# EAGLE schematic RGBDisplayDriver (EAGLE 7.3.0)
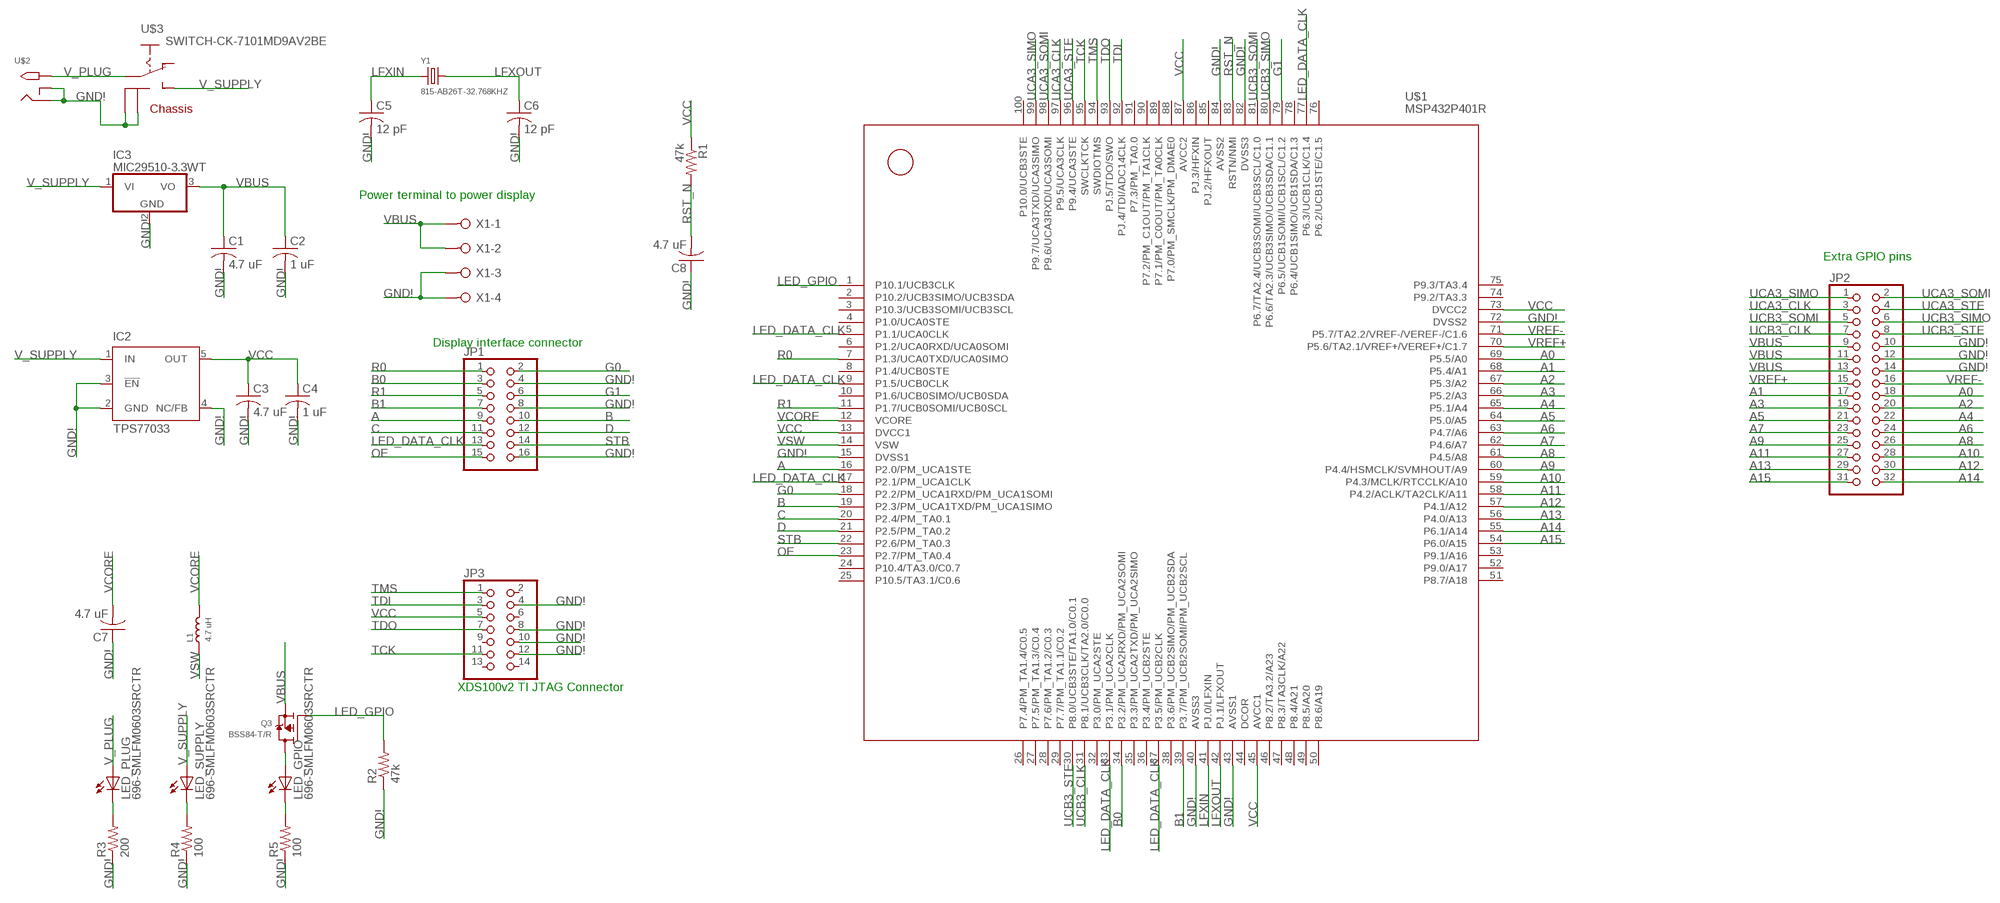
[diagram p0: schematic, sheet 1]

## Parts
C1  4.7 uF  C-USC0603  [C0603]
C2  1 uF  C-USC0603  [C0603]
C3  4.7 uF  C-USC0603  [C0603]
C4  1 uF  C-USC0603  [C0603]
C5  12 pF  C-USC0603  [C0603]
C6  12 pF  C-USC0603  [C0603]
C7  4.7 uF  C-USC0603  [C0603]
C8  4.7 uF  C-USC0603  [C0603]
IC2  TPS77033  [SOT23-DBV]
IC3  MIC29510-3.3WT  7805TV  [TO220V]
JP1  PINHD-2X8  [2X08]
JP2  PINHD-2X16  [2X16]
JP3  PINHD-2X7  [2X07]
L1  4.7 uH  SMD-FERRITE-CHIP-120-OHM-500MA(0603)  [L0603]
LED_GPIO  696-SMLFM0603SRCTR  LEDCHIPLED_0603  [CHIPLED_0603]
LED_PLUG  696-SMLFM0603SRCTR  LEDCHIPLED_0603  [CHIPLED_0603]
LED_SUPPLY  696-SMLFM0603SRCTR  LEDCHIPLED_0603  [CHIPLED_0603]
Q3  BSS84-T/R  MOSFET-PWIDE  [SOT23-WIDE]
R1  47k  R-US_R0603  [R0603]
R2  47k  R-US_R0603  [R0603]
R3  200  R-US_R0603  [R0603]
R4  100  R-US_R0603  [R0603]
R5  100  R-US_R0603  [R0603]
U$1  MSP432P401R  MSP432P401XPZ  [LQFP100]
U$2  2.1MMJACKTHM  [PJ-102A]
U$3  SWITCH-CK-7101MD9AV2BE  [SWITCH-CK-7101MD9AV2BE]
X1  W237-04P  [W237-4P]
Y1  815-AB26T-32.768KHZ  CRYSTAL32.768  [CRYSTAL_CYL_2X6MM_SMT]

## Nets
A: JP1.9 U$1.16(P2.0/PM_UCA1STE)
A0: JP2.18 U$1.69(P5.5/A0)
A1: JP2.17 U$1.68(P5.4/A1)
A2: JP2.20 U$1.67(P5.3/A2)
A3: JP2.19 U$1.66(P5.2/A3)
A4: JP2.22 U$1.65(P5.1/A4)
A5: JP2.21 U$1.64(P5.0/A5)
A6: JP2.24 U$1.63(P4.7/A6)
A7: JP2.23 U$1.62(P4.6/A7)
A8: JP2.26 U$1.61(P4.5/A8)
A9: JP2.25 U$1.60(P4.4/HSMCLK/SVMHOUT/A9)
A10: JP2.28 U$1.59(P4.3/MCLK/RTCCLK/A10)
A11: JP2.27 U$1.58(P4.2/ACLK/TA2CLK/A11)
A12: JP2.30 U$1.57(P4.1/A12)
A13: JP2.29 U$1.56(P4.0/A13)
A14: JP2.32 U$1.55(P6.1/A14)
A15: JP2.31 U$1.54(P6.0/A15)
B: JP1.10 U$1.19(P2.3/PM_UCA1TXD/PM_UCA1SIMO)
B0: JP1.3 U$1.34(P3.2/PM_UCA2RXD/PM_UCA2SOMI)
B1: JP1.7 U$1.39(P3.7/PM_UCB2SOMI/PM_UCB2SCL)
C: JP1.11 U$1.20(P2.4/PM_TA0.1)
D: JP1.12 U$1.21(P2.5/PM_TA0.2)
G0: JP1.2 U$1.18(P2.2/PM_UCA1RXD/PM_UCA1SOMI)
G1: JP1.6 U$1.79(P6.5/UCB1SOMI/UCB1SCL/C1.2)
GND!: C1.2 C2.2 C3.2 C4.2 C5.2 C6.2 C7.1 C8.1 IC2.2(GND) IC2.3(!EN) IC2.4(NC/FB) IC3.2(GND) JP1.4 JP1.8 JP1.16 JP2.10 JP2.12 JP2.14 JP3.4 JP3.8 JP3.10 JP3.12 R2.1 R3.1 R4.1 R5.1 U$1.15(DVSS1) U$1.40(AVSS3) U$1.43(AVSS1) U$1.72(DVSS2) U$1.82(DVSS3) U$1.84(AVSS2) U$2.RING U$2.RING_SW U$3.P$4 U$3.P$5 X1.3 X1.4
LED_DATA_CLK: JP1.13 U$1.5(P1.1/UCA0CLK) U$1.9(P1.5/UCB0CLK) U$1.17(P2.1/PM_UCA1CLK) U$1.33(P3.1/PM_UCA2CLK) U$1.37(P3.5/PM_UCB2CLK) U$1.77(P6.3/UCB1CLK/C1.4)
LED_GPIO: Q3.1(G) R2.2 U$1.1(P10.1/UCB3CLK)
LFXIN: C5.1 U$1.41(PJ.0/LFXIN) Y1.1
LFXOUT: C6.1 U$1.42(PJ.1/LFXOUT) Y1.2
N$1: LED_GPIO.A Q3.3(D)
N$2: LED_PLUG.C R3.2
N$3: LED_SUPPLY.C R4.2
N$4: LED_GPIO.C R5.2
OE: JP1.15 U$1.23(P2.7/PM_TA0.4)
R0: JP1.1 U$1.7(P1.3/UCA0TXD/UCA0SIMO)
R1: JP1.5 U$1.11(P1.7/UCB0SOMI/UCB0SCL)
RST_N: C8.2 R1.2 U$1.83(RSTN/NMI)
STB: JP1.14 U$1.22(P2.6/PM_TA0.3)
TCK: JP3.11 U$1.95(SWCLKTCK)
TDI: JP3.3 U$1.92(PJ.4/TDI/ADC14CLK)
TDO: JP3.7 U$1.93(PJ.5/TDO/SWO)
TMS: JP3.1 U$1.94(SWDIOTMS)
UCA3_CLK: JP2.3 U$1.97(P9.5/UCA3CLK)
UCA3_SIMO: JP2.1 U$1.99(P9.7/UCA3TXD/UCA3SIMO)
UCA3_SOMI: JP2.2 U$1.98(P9.6/UCA3RXD/UCA3SOMI)
UCA3_STE: JP2.4 U$1.96(P9.4/UCA3STE)
UCB3_CLK: JP2.7 U$1.31(P8.1/UCB3CLK/TA2.0/C0.0)
UCB3_SIMO: JP2.6 U$1.80(P6.6/TA2.3/UCB3SIMO/UCB3SDA/C1.1)
UCB3_SOMI: JP2.5 U$1.81(P6.7/TA2.4/UCB3SOMI/UCB3SCL/C1.0)
UCB3_STE: JP2.8 U$1.30(P8.0/UCB3STE/TA1.0/C0.1)
V_PLUG: LED_PLUG.A U$2.TIP U$3.P$2
V_SUPPLY: IC2.1(IN) IC3.1(VI) LED_SUPPLY.A U$3.P$1
VBUS: C1.1 C2.1 IC3.3(VO) JP2.9 JP2.11 JP2.13 Q3.2(S) X1.1 X1.2
VCC: C3.1 C4.1 IC2.5(OUT) JP3.5 R1.1 U$1.13(DVCC1) U$1.45(AVCC1) U$1.73(DVCC2) U$1.87(AVCC2)
VCORE: C7.2 L1.2 U$1.12(VCORE)
VREF+: JP2.15 U$1.70(P5.6/TA2.1/VREF+/VEREF+/C1.7)
VREF-: JP2.16 U$1.71(P5.7/TA2.2/VREF-/VEREF-/C1.6)
VSW: L1.1 U$1.14(VSW)
Unconnected: JP3.2 JP3.6 JP3.9 JP3.13 JP3.14 U$1.2(P10.2/UCB3SIMO/UCB3SDA) U$1.3(P10.3/UCB3SOMI/UCB3SCL) U$1.4(P1.0/UCA0STE) U$1.6(P1.2/UCA0RXD/UCA0SOMI) U$1.8(P1.4/UCB0STE) U$1.10(P1.6/UCB0SIMO/UCB0SDA) U$1.24(P10.4/TA3.0/C0.7) U$1.25(P10.5/TA3.1/C0.6) U$1.26(P7.4/PM_TA1.4/C0.5) U$1.27(P7.5/PM_TA1.3/C0.4) U$1.28(P7.6/PM_TA1.2/C0.3) U$1.29(P7.7/PM_TA1.1/C0.2) U$1.32(P3.0/PM_UCA2STE) U$1.35(P3.3/PM_UCA2TXD/PM_UCA2SIMO) U$1.36(P3.4/PM_UCB2STE) U$1.38(P3.6/PM_UCB2SIMO/PM_UCB2SDA) U$1.44(DCOR) U$1.46(P8.2/TA3.2/A23) U$1.47(P8.3/TA3CLK/A22) U$1.48(P8.4/A21) U$1.49(P8.5/A20) U$1.50(P8.6/A19) U$1.51(P8.7/A18) U$1.52(P9.0/A17) U$1.53(P9.1/A16) U$1.74(P9.2/TA3.3) U$1.75(P9.3/TA3.4) U$1.76(P6.2/UCB1STE/C1.5) U$1.78(P6.4/UCB1SIMO/UCB1SDA/C1.3) U$1.85(PJ.2/HFXOUT) U$1.86(PJ.3/HFXIN) U$1.88(P7.0/PM_SMCLK/PM_DMAE0) U$1.89(P7.1/PM_C0OUT/PM_TA0CLK) U$1.90(P7.2/PM_C1OUT/PM_TA1CLK) U$1.91(P7.3/PM_TA0.0) U$1.100(P10.0/UCB3STE) U$3.P$3

## Notes on the sheet
- Power terminal to power display
- Extra GPIO pins
- Display interface connector
- XDS100v2 TI JTAG Connector

## Library data of the parts
C1-C8 = adafruit:C-US: CAPACITOR, American symbol
IC2 = texas:TPS770*: ULTRALOW-POWER 50-mA LOW-DROPOUT LINEAR REGULATORS 50-mA Low-Dropout Regulator Source: http://focus.ti.com/lit/ds/symlink/tps77001.pdf; MF: TEXAS INSTRUMENTS; MPN: TPS77033DBVT; OC_FARNELL: 8461570; OC_NEWARK: 77C1187
IC3 = linear:78*: Positive VOLTAGE REGULATOR Source: http://cache.national.com/ds/LM/LM78L05.pdf http://www.fairchildsemi.com/ds/LM/LM7805.pdf
JP1 = pinhead:PINHD-2X8: PIN HEADER
JP2 = pinhead:PINHD-2X16: PIN HEADER
JP3 = pinhead:PINHD-2X7: PIN HEADER
L1 = Seeed-OPL-Inductor:SMD-FERRITE-CHIP-120-OHM-500MA(0603): 303030001; MPN: BLM18AG121SN1D; VALUE: 120
LED_GPIO LED_PLUG LED_SUPPLY = adafruit:LED: LED OSRAM: - CHIPLED LG R971, LG N971, LY N971, LG Q971, LY Q971, LO R971, LY R971 LH N974, LH R974 LS Q976, LO Q976, LY Q976 LO Q996 - Hyper CHIPLED LW Q18S LB Q993, LB Q99A, LB R99A - SideLED LS A670, LO A670, LY A670, LG A670, LP A670 LB A673, LV A673, LT A673, LW A673 LH A674 LY A675 LS A676, LA A676, LO A676, LY A676, LW A676 LS A679, LY A679, LG A679 - Hyper Micro SIDELED® LS Y876, LA Y876, LO Y876, LY Y876 LT Y87S - SmartLED LW L88C, LW L88S LB L89C, LB L89S, LG L890 LS L89K, LO L89K, LY L89K LS L896, LA L896, LO L896, LY L896 - TOPLED LS T670, LO T670, LY T670, LG T670, LP T670 LSG T670, LSP T670, LSY T670, LOP T670, LYG T670 LG T671, LOG T671, LSG T671 LB T673, LV T673, LT T673, LW T673 LH T674 LS T676, LA T676, LO T676, LY T676, LB T676, LH T676, LSB T676, LW T676 LB T67C, LV T67C, LT T67C, LS T67K, LO T67K, LY T67K, LW E67C LS E67B, LA E67B, LO E67B, LY E67B, LB E67C, LV E67C, LT E67C LW T67C LS T679, LY T679, LG T679 LS T770, LO T770, LY T770, LG T770, LP T770 LB T773, LV T773, LT T773, LW T773 LH T774 LS E675, LA E675, LY E675, LS T675 LS T776, LA T776, LO T776, LY T776, LB T776 LHGB T686 LT T68C, LB T68C - Hyper Mini TOPLED® LB M676 - Mini TOPLED Santana® LG M470 LS M47K, LO M47K, LY M47K Source: http://www.osram.convergy.de/
Q3 = microbuilder:MOSFET-P: P-Channel Mosfet LEGEND VDS: Voltage Drain-Source ID: Drain Current RDS(ON): Drain-Source On-State Resistance VGS(TH): Gate-Source Threshold Voltage CISS: Drain-Source Input Capacitance SOT-23 Name VDS ID RDS(ON) VGS(TH) CISS Order Number IRLML5103 30V 760mA 600 mOhm -- 75pF @ 25V Digikey: IRLML5103PBFCT-ND IRLML6401 12V 4.3A 50 mOhm 950mV @ 250µA 830pF @ 10V Digikey: IRLML6401PBFTR-ND NTR0202PL 20V 400mA 800 mOhm 2.3V @ 250uA 70pF @ 5V Digikey: NTR0202PLT1GOSTR-ND NTR4101PT1G 20V 1.8A 85 mOhm 1.2V @ 250uA 675pF @ 10V Digikey: NTR4101PT1GOSCT-ND DMP2004K 20V 600mA 900 mOhm 1V @ 250uA 175pF @ 16V Digikey: DMP2004KDICT-ND PMV65XP 20V 3.9A 76 mOhm 950mV @ 1mA 725pF @ 20V Digikey: 568-2358-2-ND TO-252 Name VDS ID RDS(ON) VGS(TH) CISS Order Number AOD417 30V 25A 34 mOhm 3V @ 250µA 920pF @ 15V Digikey: 785-1106-2-ND
R1-R5 = resistor:R-US_: RESISTOR, American symbol
U$1 = MSP432P401x_EAGLE_LIB:MSP432P401X: MSP432P401R/M Texas Instruments
U$2 = adafruit:2.1MMJACK: 2.1mm x 5.5mm THM DC jack with internal switch. Digikey part #PJ-102A, 4UCON part #05537 2.1mm x 5.5mm SMT DC jack with internal switch. Digikey part #PJ-002A-SMT, 4UCON part #03267 By microbuilder.eu & adafruit.com
U$3 = misc_components:SWITCH-CK-7101MD9AV2BE
X1 = con-wago-508:W237-04P: WAGO SREW CLAMP; OC_FARNELL: unknown; OC_NEWARK: unknown
Y1 = microbuilder:CRYSTAL: Crystals HC49UP - Surface Mount Crystal 4.0MHz 18pF +/-30ppm Surface Mount Crystal [Digikey: 535-9857-1-ND] 12.0 MHz Surface Mount Crystal [Digikey: 535-9869-6-ND] 25.0 MHz Surface Mount Crystal [Digikey: 535-9078-1-ND] 2.5 x 2.0mm - MEMs SMT Crystal 16.0 MHz 10pF 20ppm 2.5 x 2.0mm Crystal [Digikey -40-85°C: 535-10923-1-ND] 3.2 x 2.5mm - MEMs SMT Crystal 12.0 MHz 8pF 15ppm 3.2 x 2.5mm Crystal [Digikey: -10-70°C: 644-1047-1-ND -40-125°C: 644-1128-1-ND] 16.0 MHz 8pF 15ppm 3.2 x 2.5mm Crystal [Digikey: -10-70°C: 644-1049-1-ND -40-125°C: 644-1129-2-ND] 16.0 MHz 10pF 10ppm 3.2 x 2.5mm Crystal [Digikey: 644-1100-1-ND] 27.12 MHz 18pF 30ppm 3.2 x 2.5mm Crystal [Digikey: 887-1424-1-ND] 27.12MHz 10pF 10ppm 3.2 x 2.5mm Crystal [Digikey: 887-1329-1-ND] 4.9 x 1.8mm - MEMs SMT Crystal 32.768 KHz 12.5pF 20ppm 4.9 x 1.8mm Crystal [Digikey: SE2415CT-ND] 8.0 x 3.8mm - Surface Mount Crystal 32.768kHz 12.5pF 20ppm -40°C-85°C [Digikey: 535-9166-2-ND] Cylinder 32.768KHz Cylinder Crystal (2x6mm body) [Ex. Digikey: 300-8341-2-ND]